# Altium schematic sheet micro.SchDoc
size A4
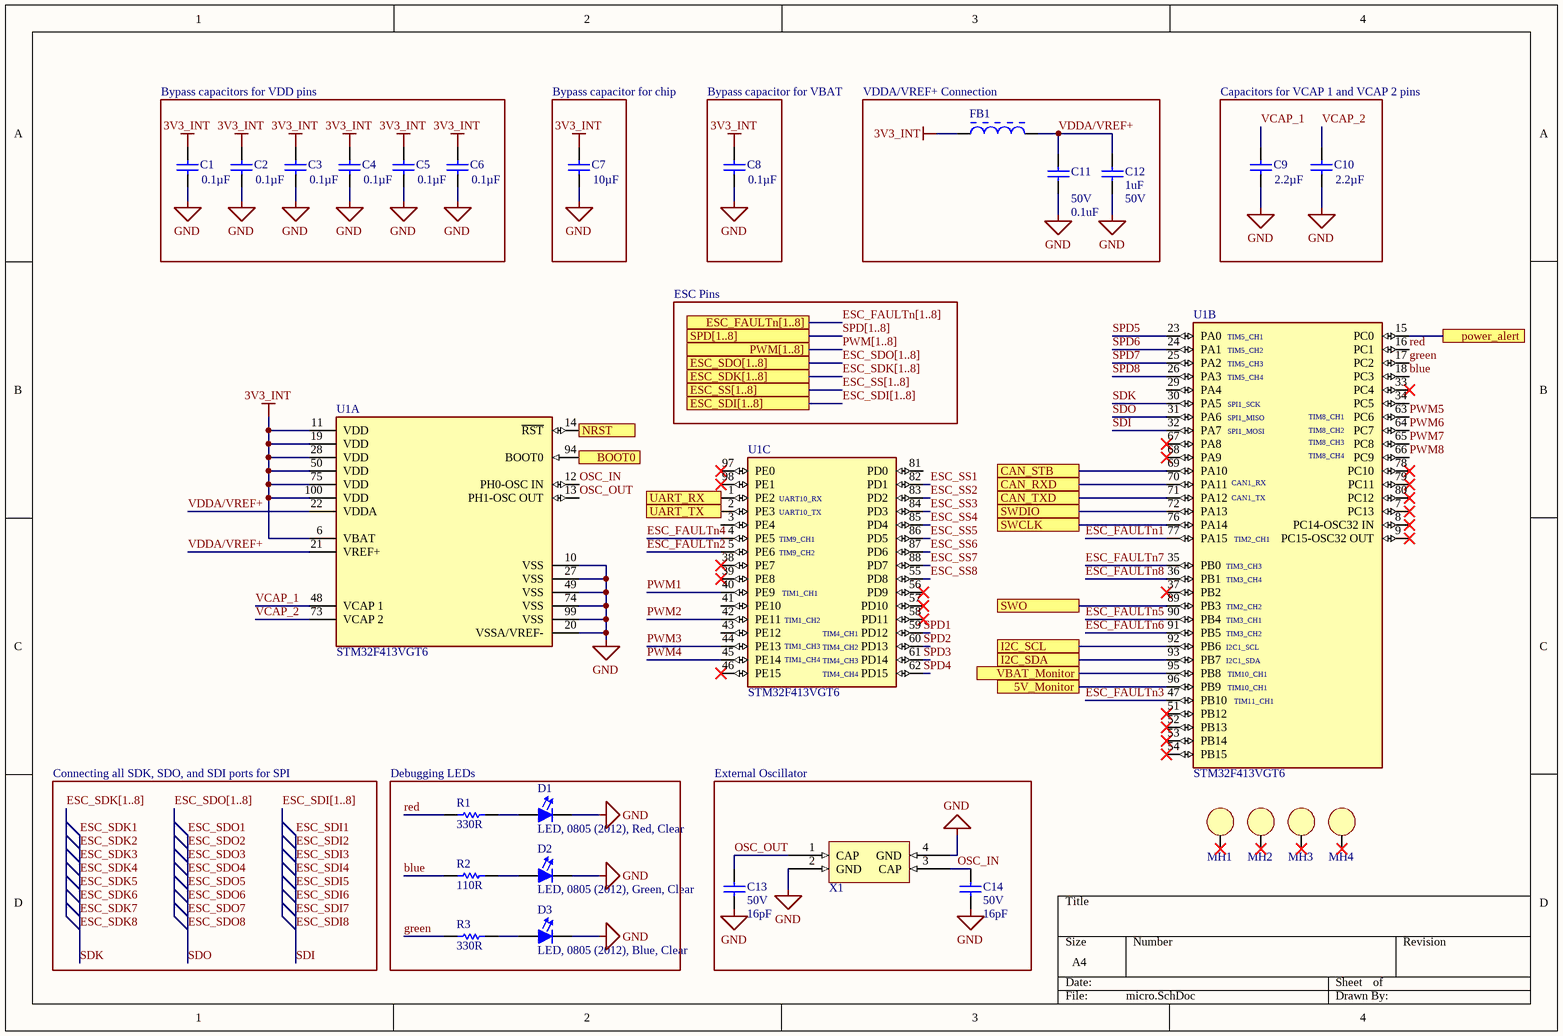
[diagram p0: micro.SchDoc]

## Parts
C1  value 0.1µF  [CAPC1608N(0603")]  (hidden comment: 0.1uF 16V 0603 SMD, Ceramic)
C2  value 0.1µF  [CAPC1608N(0603")]  (hidden comment: 0.1uF 16V 0603 SMD, Ceramic)
C3  value 0.1µF  [CAPC1608N(0603")]  (hidden comment: 0.1uF 16V 0603 SMD, Ceramic)
C4  value 0.1µF  [CAPC1608N(0603")]  (hidden comment: 0.1uF 16V 0603 SMD, Ceramic)
C5  value 0.1µF  [CAPC1608N(0603")]  (hidden comment: 0.1uF 16V 0603 SMD, Ceramic)
C6  value 0.1µF  [CAPC1608N(0603")]  (hidden comment: 0.1uF 16V 0603 SMD, Ceramic)
C7  value 10µF  [CAPC2012N(0805")]  (hidden comment: 10uF 10V 0805 SMD, Ceramic)
C8  value 0.1µF  [CAPC1608N(0603")]  (hidden comment: 0.1uF 16V 0603 SMD, Ceramic)
C9  value 2.2µF  [CAPC1608N(0603")]  (hidden comment: 2.2uF, 50V, 0603 SMD, X5R, Ceramic)
C10  value 2.2µF  [CAPC1608N(0603")]  (hidden comment: 2.2uF, 50V, 0603 SMD, X5R, Ceramic)
C11  Voltage: 50V  Capacitance: 0.1uF  [FP-CL10-0_1-MFG]  (hidden comment: CL10B104JB8NNNC)
C12  Capacitance: 1uF  Voltage: 50V  [0803 CAP]  (hidden comment: CL21B105KBFNNNG)
C13  Voltage: 50V  Capacitance: 16pF  [CAPC1608X90X35LL10T15]  (hidden comment: 16pF Ceramic 50V 5% 0603)
C14  Voltage: 50V  Capacitance: 16pF  [CAPC1608X90X35LL10T15]  (hidden comment: 16pF Ceramic 50V 5% 0603)
D1  LED, 0805 (2012), Red, Clear  [LED0805]
D2  LED, 0805 (2012), Green, Clear  [LED0805]
D3  LED, 0805 (2012), Blue, Clear  [LED0805]
FB1  BLM18AG601SN1D  [MURA-BLM18-F-H1-CHIP-2_V]  (value not drawn)
MH1  Mount_Hole_3mm  [Mount-Hole_3mm]  (value not drawn)
MH2  Mount_Hole_3mm  [Mount-Hole_3mm]  (value not drawn)
MH3  Mount_Hole_3mm  [Mount-Hole_3mm]  (value not drawn)
MH4  Mount_Hole_3mm  [Mount-Hole_3mm]  (value not drawn)
R1  Resistance: 330R  [FP-CRCW0603-e3-IPC_C]  (hidden comment: CRCW0603330RFKEA)
R2  Resistance: 110R  [RESC1608X55X25ML10T15]  (hidden comment: RC0603FR-07110RL)
R3  Resistance: 330R  [FP-CRCW0603-e3-IPC_C]  (hidden comment: CRCW0603330RFKEA)
U1  STM32F413VGT6  [FP-LQFP100-1L-IPC_C]  (parts A,B,C of 3)
X1  CRYSTAL 8.0MHZ 16PF SMD  [QFN250P750X520X140_HS-5M]  (value not drawn)

## Blocks framed on the sheet
Bypass capacitors for VDD pins: C1-C6
Bypass capacitor for chip: C7
Bypass capacitor for VBAT: C8
VDDA/VREF+ Connection: C11 C12 FB1
Capacitors for VCAP 1 and VCAP 2 pins: C9 C10
Debugging LEDs: D1-D3 R1-R3
External Oscillator: C13 C14 X1

## Ports
5V_Monitor, BOOT0, CAN_RXD, CAN_STB, CAN_TXD, ESC_FAULTn[1..8], ESC_SDI[1..8], ESC_SDK[1..8], ESC_SDO[1..8], ESC_SS[1..8], I2C_SCL, I2C_SDA, NRST, power_alert, PWM[1..8], SPD[1..8], SWCLK, SWDIO, SWO, UART_RX, UART_TX, VBAT_Monitor

## Nets
3V3_INT: C1.2(Cathode) C2.2(Cathode) C3.2(Cathode) C4.2(Cathode) C5.2(Cathode) C6.2(Cathode) C7.2(Cathode) C8.2(Cathode) FB1.1 U1.6(VBAT) U1.11(VDD) U1.19(VDD) U1.28(VDD) U1.50(VDD) U1.75(VDD) U1.100(VDD)
GND: C1.1(Anode) C2.1(Anode) C3.1(Anode) C4.1(Anode) C5.1(Anode) C6.1(Anode) C7.1(Anode) C8.1(Anode) C9.1(Anode) C10.1(Anode) C11.2 C12.1 C13.1 C14.1 D1.1(Cathode) D2.1(Cathode) D3.1(Cathode) U1.10(VSS) U1.20(VSSA/VREF-) U1.27(VSS) U1.49(VSS) U1.74(VSS) U1.99(VSS) X1.2(GND) X1.4(GND)
5V_Monitor: U1.96(PB9) ; port 5V_Monitor
blue: R2.1 U1.18(PC3)
BOOT0: U1.94(BOOT0) ; port BOOT0
CAN_RXD: U1.70(PA11) ; port CAN_RXD
CAN_STB: U1.69(PA10) ; port CAN_STB
CAN_TXD: U1.71(PA12) ; port CAN_TXD
ESC_FAULTn1: U1.77(PA15)
ESC_FAULTn2: U1.5(PE6)
ESC_FAULTn3: U1.47(PB10)
ESC_FAULTn4: U1.4(PE5)
ESC_FAULTn5: U1.90(PB4)
ESC_FAULTn6: U1.91(PB5)
ESC_FAULTn7: U1.35(PB0)
ESC_FAULTn8: U1.36(PB1)
ESC_SDI1: U1.32(PA7)  [also labelled ESC_SDI2, ESC_SDI3, ESC_SDI4, ESC_SDI5, ESC_SDI6, ESC_SDI7, ESC_SDI8, SDI]
ESC_SDK1: U1.30(PA5)  [also labelled ESC_SDK2, ESC_SDK3, ESC_SDK4, ESC_SDK5, ESC_SDK6, ESC_SDK7, ESC_SDK8, SDK]
ESC_SDO1: U1.31(PA6)  [also labelled ESC_SDO2, ESC_SDO3, ESC_SDO4, ESC_SDO5, ESC_SDO6, ESC_SDO7, ESC_SDO8, SDO]
ESC_SS1: U1.82(PD1)
ESC_SS2: U1.83(PD2)
ESC_SS3: U1.84(PD3)
ESC_SS4: U1.85(PD4)
ESC_SS5: U1.86(PD5)
ESC_SS6: U1.87(PD6)
ESC_SS7: U1.88(PD7)
ESC_SS8: U1.55(PD8)
green: R3.1 U1.17(PC2)
I2C_SCL: U1.92(PB6) ; port I2C_SCL
I2C_SDA: U1.93(PB7) ; port I2C_SDA
NRST: U1.14(~{RST}) ; port NRST
OSC_IN: C14.2 U1.12(PH0-OSC_IN) X1.3(CAP)
OSC_OUT: C13.2 U1.13(PH1-OSC_OUT) X1.1(CAP)
power_alert: U1.15(PC0) ; port power_alert
PWM1: U1.40(PE9)
PWM2: U1.42(PE11)
PWM3: U1.44(PE13)
PWM4: U1.45(PE14)
PWM5: U1.63(PC6)
PWM6: U1.64(PC7)
PWM7: U1.65(PC8)
PWM8: U1.66(PC9)
red: R1.1 U1.16(PC1)
SPD1: U1.59(PD12)
SPD2: U1.60(PD13)
SPD3: U1.61(PD14)
SPD4: U1.62(PD15)
SPD5: U1.23(PA0)
SPD6: U1.24(PA1)
SPD7: U1.25(PA2)
SPD8: U1.26(PA3)
SWCLK: U1.76(PA14) ; port SWCLK
SWDIO: U1.72(PA13) ; port SWDIO
SWO: U1.89(PB3) ; port SWO
UART_RX: U1.1(PE2) ; port UART_RX
UART_TX: U1.2(PE3) ; port UART_TX
VBAT_Monitor: U1.95(PB8) ; port VBAT_Monitor
VCAP_1: C9.2(Cathode) U1.48(VCAP_1)
VCAP_2: C10.2(Cathode) U1.73(VCAP_2)
VDDA/VREF+: C11.1 C12.2 FB1.2 U1.21(VREF+) U1.22(VDDA)
NetD1_2: D1.2(Anode) R1.2
NetD2_2: D2.2(Anode) R2.2
NetD3_2: D3.2(Anode) R3.2

Not connected (* = marked no-connect by the designer): MH1 1*; MH2 1*; MH3 1*; MH4 1*; U1 3(PE4) 7(PC13)* 8(PC14-OSC32_IN)* 9(PC15-OSC32_OUT)* 29(PA4) 33(PC4)* 34(PC5) 37(PB2)* 38(PE7)* 39(PE8)* 41(PE10) 43(PE12) 46(PE15)* 51(PB12)* 52(PB13)* 53(PB14)* 54(PB15)* 56(PD9)* 57(PD10)* 58(PD11)* 67(PA8)* 68(PA9)* 78(PC10)* 79(PC11)* 80(PC12)* 81(PD0) 97(PE0)* 98(PE1)*

## Buses and harness runs
bus ESC_FAULTn[1..8] = port ESC_FAULTn[1..8]
bus ESC_SDI[1..8]
bus ESC_SDI[1..8] = port ESC_SDI[1..8]
bus ESC_SDK[1..8]
bus ESC_SDK[1..8] = port ESC_SDK[1..8]
bus ESC_SDO[1..8]
bus ESC_SDO[1..8] = port ESC_SDO[1..8]
bus ESC_SS[1..8] = port ESC_SS[1..8]
bus PWM[1..8] = port PWM[1..8]
bus SPD[1..8] = port SPD[1..8]

## Notes on the sheet
- ESC Pins
- (near U1) TIM5_CH1
- (near U1) TIM5_CH2
- (near U1) TIM5_CH3
- (near U1) TIM5_CH4
- (near U1) SPI1_SCK
- (near U1) SPI1_MISO
- (near U1) SPI1_MOSI
- (near U1) TIM8_CH1
- (near U1) TIM8_CH2
- (near U1) TIM8_CH3
- (near U1) UART10_RX
- (near U1) UART10_TX
- (near U1) CAN1_RX
- (near U1) CAN1_TX
- (near U1) TIM8_CH4
- (near U1) TIM9_CH1
- (near U1) TIM9_CH2
- (near U1) TIM3_CH3
- (near U1) TIM3_CH4
- (near U1) TIM2_CH1
- (near U1) TIM1_CH1
- (near U1) TIM1_CH2
- (near U1) TIM1_CH3
- (near U1) TIM4_CH1
- (near U1) TIM4_CH2
- (near U1) TIM2_CH2
- (near U1) TIM3_CH1
- (near U1) TIM3_CH2
- (near U1) I2C1_SCL
- (near U1) TIM1_CH4
- (near U1) TIM4_CH3
- (near U1) TIM4_CH4
- (near U1) I2C1_SDA
- (near U1) TIM10_CH1
- (near U1) TIM11_CH1
- Connecting all SDK, SDO, and SDI ports for SPI

## Library data of the parts
C1-C6 C8 = CMP-006-0005-1: Capacitor, Ceramic, 16V, +/- 10%, 0603 SMD, X7R; Created By: Andy Bates; Published: 16-04-26; PackageDescription: Chip Capacitor; Pin Count: 2; Source: AUVic_Schematic_Library_Capacitors.SchLib; Design Item ID: 0.1uF 16V 0603 SMD, Ceramic; Component Type: Standard; Publisher: AUVic
C7 = CMP-006-0017-1: Capacitor, Ceramic, 10V, +/- 10%, 0805 SMD, X5R; Made By: Andy Bates; Source: AUVic_Schematic_Library_Capacitors.SchLib; Pin Count: 2; PackageDescription: Chip Capacitor; Design Item ID: 10uF 10V 0805 SMD, Ceramic; Component Type: Standard; Publisher: AUVic; Published: 14-06-23
C9 C10 = CMP-006-0030-1: Capacitor, Ceramic, 50V, 10%, 0603 SMD, X5R; Date Created: *; Design Item ID: 2.2uF, 50V, 0603 SMD, X5R, Ceramic; Made By: *; Publisher: AUVic; Source: AUVic_Schematic_Library_Capacitors.SchLib; Pin Count: 2; PackageDescription: Chip Capacitor; Component Type: Standard
C11 = CMP-00000-3: CAP CER 0.1UF 50V X7R 0603; Tolerance: 5%; Material: Ceramic; Case Code (Imperial): 0603; Mount: Surface Mount; Thickness: 0.035inch; Depth: 0.8mm; Packaging: Tape and Reel; Package Quantity: 1; Dielectric: X7R; Height: 0.8mm; Radiation Hardening: No; Max Operating Temperature: 125°C; Voltage Rating: 50V; Case/Package: 0603; Min Operating Temperature: -55°C; Case Code (Metric): 1608; Length: 1.6mm; Contact Plating: Tin; Width: 0.031inch
C12 = CMP-00005-3: SAMSUNG ELECTRO-MECHANICS - CL21B105KBFNNNG - MLCC CAPACITORS; Dielectric: X7R; Tolerance: 10%; Material: Ceramic; Min Operating Temperature: -55°C; Length: 2mm; Termination: Wraparound; Contact Plating: Tin; Package Quantity: 3000; Mount: Surface Mount; Max Operating Temperature: 125°C; Case Code (Imperial): 0805; Thickness: 0.053inch; Case/Package: 0805; Width: 0.049inch; Voltage Rating: 50V; Depth: 1.25mm; Packaging: Tape and Reel; Case Code (Metric): 2012
C13 C14 = CMP-00087-2: Cap Ceramic 16pF 50V C0G 5% SMD 0603 125C Paper T/R; Temperature Coefficient: 30ppm/°C; Termination: SMD/SMT; Voltage Rating: 50V; Dielectric: C0G; Radiation Hardening: No; Voltage Rating (DC): 50V; Max Operating Temperature: 125°C; Height: 0.8mm; Width: 0.8mm; Length: 1.6mm; Package Quantity: 1; Lead Free: Lead Free; Min Operating Temperature: -55°C; Case Code (Metric): 1608; Case/Package: 0603; Tolerance: 5%; Mount: Surface Mount; Thickness: 0.035inch; Case Code (Imperial): 0603; Depth: 0.8mm; Packaging: Tape and Reel
D1 = CMP-057-0011-2: Design Item ID: LED, 0805 (2012), Red, Clear; Colour: Red; Component Type: Standard; Pin Count: 2; Created By: Ashwin Sira; Source: AUVic_Schematic_Library_Diodes.SchLib
D2 = CMP-057-0009-2: Created By: Andy Bates; Pin Count: 2; Design Item ID: LED, 0805 (2012), Green, Clear; Source: AUVic_Schematic_Library_Diodes.SchLib; Component Type: Standard; Colour: Green
D3 = CMP-057-0008-2: Colour: Red; Design Item ID: LED, 0805 (2012), Blue, Clear; Component Type: Standard; Pin Count: 2; Source: AUVic_Schematic_Library_Diodes.SchLib; Created By: Ashwin Sira
FB1 = CMP-00016-1: MURATA - BLM18AG601SN1D - Feritový Korálek, 0603 / 1608, 600 ohm, 500 mA, Série BLM18A, 0.38 ohm, ± 25%; DC Current: 500mA; Impedance: 600R; DC Resistance (DCR): 380mR; Core Material: Ferrite; Shielding: Unshielded; Number of Lines: 1; Test Frequency: 100MHz; Material: Steel,Ferrite; Height: 0.8mm; Depth: 0.8mm; Min Operating Temperature: -55°C; Packaging: Tape and Reel; Weight: 7.1E-05oz; Width: 0.8mm; Military Standard: Not; Max Operating Temperature: 125°C; Max Current Rating: 500mA; Case Code (Metric): 1608; Length: 1.6mm; Case Code (Imperial): 0603; Package Quantity: 1; Max DC Current: 500mA; REACH SVHC: No SVHC; Termination: SMD/SMT; Current Rating: 500mA; Lead Free: Lead Free; Tolerance: 25%; Case/Package: 0603; Number of Pins: 2; Radiation Hardening: No; Frequency: 100MHz; Number of Circuits: 1
MH1-MH4 = CMP-004-0010-4: Mounting hold for M3 hex standoff; Design Item ID: Mount_Hole_3mm; Pin Count: 1; Source: AUVic_Schematic_Library_Connectors.SchLib; Component Type: Standard
R1 R3 = CMP-00067-2: Res Thick Film 0603 330 Ohm 1% 0.1W(1/10W) +/-100ppm/ßC Pad SMD Automotive T/R; Voltage Rating (DC): 75V; Power Rating: 100mW; Temperature Coefficient: 100ppm/°C; Contact Plating: Tin; Package Quantity: 10; Tolerance: 1%; Packaging: Tape and Reel; Case/Package: 0603; Max Operating Temperature: 155°C; Case Code (Metric): 1608; Case Code (Imperial): 0603; Min Operating Temperature: -55°C; Length: 1.55mm; Height: 0.45mm; Lead Free: Lead Free; Termination: SMD/SMT; Voltage Rating: 75V; Composition: Thick Film; Weight: 7.1E-05oz; Military Standard: Not; Max Power Dissipation: 100mW; REACH SVHC: Unknown; Mount: Surface Mount; Depth: 0.85mm; Features: Automotive AEC-Q200; Number of Terminations: 2; Radiation Hardening: No; Width: 0.033inch
R2 = CMP-00069-1: RES SMD 110 OHM 1% 1/10W 0603; Max Power Dissipation: 100mW; Voltage Rating (DC): 50V; Temperature Coefficient: 100ppm/°C; Working Voltage: 75V; Military Standard: Not; Termination: SMD/SMT; Number of Terminations: 2; Features: Moisture Resistant; Min Operating Temperature: -55°C; Power Rating: 100mW; Height: 0.022inch; Package Quantity: 1; Lead Free: Lead Free; Tolerance: 1%; Voltage Rating: 50V; Composition: Thick Film; Case Code (Imperial): 0603; Length: 1.6mm; Packaging: Tape and Reel; Case Code (Metric): 1608; Max Operating Temperature: 155°C; Depth: 0.8mm; Case/Package: 0603; Width: 0.031inch
U1 = CMP-00007-3: IC MCU 32BIT 1MB FLASH 100LQFP; Peripherals: Brown-out Detect/Reset,POR,PWM,WDT,DMA,LCD; Frequency: 100MHz; Number of I/Os: 81; Core Architecture: ARM; Oscillator Type: Internal; Interface: I2C,SPI,USB,IrDA,MMC,SDIO,UART,USART,EBI/EMI; Packaging: Tray; Max Operating Temperature: 85°C; Memory Size: 1MB; Min Operating Temperature: -40°C; Memory Type: FLASH; Case/Package: LQFP
X1 = CMP-00079-3: 8MHz ±30ppm Crystal 16pF 80 Ohms 4-SMD, No Lead; ESR (Equivalent Series Resistance): 80R; Frequency Stability: 50ppm; Case/Package: CSMD; Load Capacitance: 16pF; Number of Pins: 4; Min Operating Temperature: -20°C; Depth: 5.2mm; Max Operating Temperature: 70°C; Length: 7.5mm; Packaging: Tape and Reel; Frequency: 8MHz